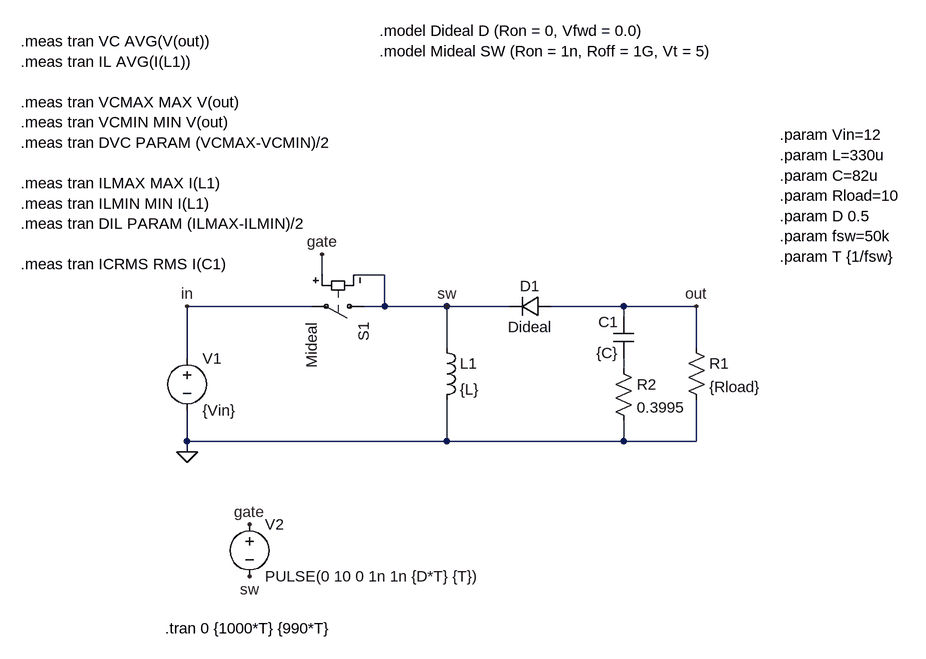
[diagram p0: schematic buckBoostIdeal.asc]
buckBoostIdeal.asc, the LTspice schematic file:
Version 4
SHEET 1 1192 820
WIRE 224 32 224 0
WIRE 320 32 272 32
WIRE 208 80 16 80
WIRE 320 80 320 32
WIRE 320 80 288 80
WIRE 416 80 320 80
WIRE 512 80 416 80
WIRE 688 80 576 80
WIRE 800 80 688 80
WIRE 688 96 688 80
WIRE 416 144 416 80
WIRE 800 144 800 80
WIRE 16 160 16 80
WIRE 688 176 688 160
WIRE 16 288 16 240
WIRE 416 288 416 224
WIRE 416 288 16 288
WIRE 688 288 688 256
WIRE 688 288 416 288
WIRE 800 288 800 224
WIRE 800 288 688 288
WIRE 16 304 16 288
FLAG 16 304 0
FLAG 800 80 out
FLAG 16 80 in
FLAG 416 80 sw
FLAG 224 0 gate
FLAG 112 496 sw
FLAG 112 416 gate
SYMBOL voltage 16 144 R0
WINDOW 123 0 0 Left 0
WINDOW 39 0 0 Left 0
SYMATTR InstName V1
SYMATTR Value {Vin}
SYMBOL res 784 128 R0
SYMATTR InstName R1
SYMATTR Value {Rload}
SYMBOL ind 400 128 R0
SYMATTR InstName L1
SYMATTR Value {L}
SYMBOL cap 704 160 R180
WINDOW 0 24 56 Left 2
WINDOW 3 24 8 Left 2
SYMATTR InstName C1
SYMATTR Value {C}
SYMBOL diode 576 64 R90
WINDOW 0 0 32 VBottom 2
WINDOW 3 32 32 VTop 2
SYMATTR InstName D1
SYMATTR Value Dideal
SYMBOL sw 304 80 R90
SYMATTR InstName S1
SYMATTR Value Mideal
SYMBOL voltage 112 400 R0
WINDOW 123 0 0 Left 0
WINDOW 39 0 0 Left 0
SYMATTR InstName V2
SYMATTR Value PULSE(0 10 0 1n 1n {D*T} {T})
SYMBOL res 672 160 R0
SYMATTR InstName R2
SYMATTR Value 0.3995
TEXT 928 -184 Left 2 !.param Vin=12 \n.param L=330u \n.param C=82u \n.param Rload=10 \n.param D 0.5\n.param fsw=50k\n.param T {1/fsw}
TEXT -18 576 Left 2 !.tran 0 {1000*T} {990*T}
TEXT 312 -344 Left 2 !.model Dideal D (Ron = 0, Vfwd = 0.0)\n.model Mideal SW (Ron = 1n, Roff = 1G, Vt = 5)
TEXT -240 -328 Left 2 !.meas tran VC AVG(V(out))\n.meas tran IL AVG(I(L1))\n \n.meas tran VCMAX MAX V(out)\n.meas tran VCMIN MIN V(out)\n.meas tran DVC PARAM (VCMAX-VCMIN)/2\n \n.meas tran ILMAX MAX I(L1)\n.meas tran ILMIN MIN I(L1)\n.meas tran DIL PARAM (ILMAX-ILMIN)/2\n \n.meas tran ICRMS RMS I(C1)

The netlist it stands for:
* buckBoostIdeal.asc
V1 in 0 {Vin}
R1 out 0 {Rload}
L1 sw 0 {L}
C1 N001 out {C}
D1 out sw Dideal
S1 sw in gate sw Mideal
V2 gate sw PULSE(0 10 0 1n 1n {D*T} {T})
R2 N001 0 0.3995
.model D D
.lib standard.dio
.param Vin=12
.param L=330u
.param C=82u
.param Rload=10
.param D 0.5
.param fsw=50k
.param T {1/fsw}
.tran 0 {1000*T} {990*T}
.model Dideal D (Ron = 0, Vfwd = 0.0)
.model Mideal SW (Ron = 1n, Roff = 1G, Vt = 5)
.meas tran VC AVG(V(out))
.meas tran IL AVG(I(L1))
.meas tran VCMAX MAX V(out)
.meas tran VCMIN MIN V(out)
.meas tran DVC PARAM (VCMAX-VCMIN)/2
.meas tran ILMAX MAX I(L1)
.meas tran ILMIN MIN I(L1)
.meas tran DIL PARAM (ILMAX-ILMIN)/2
.meas tran ICRMS RMS I(C1)
.backanno
.end